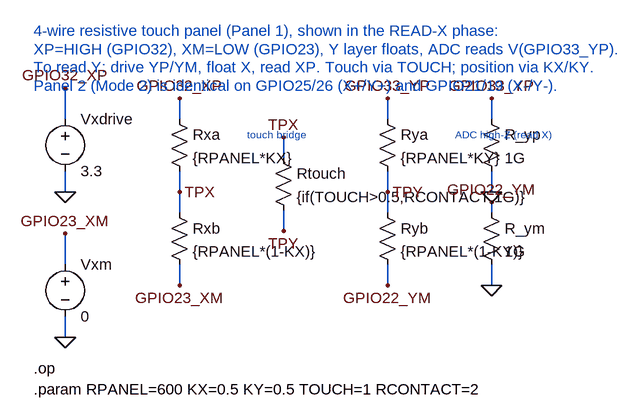
[diagram p0: schematic touch_panel.asc]
touch_panel.asc, the LTspice schematic file:
Version 4
SHEET 1 880 760
WIRE -160 -32 -160 16
WIRE -160 96 -160 128
WIRE -160 192 -160 240
WIRE -160 320 -160 352
WIRE 16 -16 16 16
WIRE 16 96 16 128
WIRE 16 128 16 160
WIRE 16 240 16 272
WIRE 176 44 176 76
WIRE 176 156 176 188
WIRE 336 -16 336 16
WIRE 336 96 336 128
WIRE 336 128 336 160
WIRE 336 240 336 272
WIRE 496 -16 496 16
WIRE 496 96 496 128
WIRE 496 144 496 160
WIRE 496 240 496 272
FLAG -160 -32 GPIO32_XP
FLAG -160 128 0
FLAG -160 192 GPIO23_XM
FLAG -160 352 0
FLAG 16 -16 GPIO32_XP
FLAG 16 128 TPX
FLAG 16 272 GPIO23_XM
FLAG 176 44 TPX
FLAG 176 188 TPY
FLAG 336 -16 GPIO33_YP
FLAG 336 128 TPY
FLAG 336 272 GPIO22_YM
FLAG 496 -16 GPIO33_YP
FLAG 496 128 0
FLAG 496 144 GPIO22_YM
FLAG 496 272 0
SYMBOL voltage -160 0 R0
SYMATTR InstName Vxdrive
SYMATTR Value 3.3
SYMBOL voltage -160 224 R0
SYMATTR InstName Vxm
SYMATTR Value 0
SYMBOL res 0 0 R0
SYMATTR InstName Rxa
SYMATTR Value {RPANEL*KX}
SYMBOL res 0 144 R0
SYMATTR InstName Rxb
SYMATTR Value {RPANEL*(1-KX)}
SYMBOL res 320 0 R0
SYMATTR InstName Rya
SYMATTR Value {RPANEL*KY}
SYMBOL res 320 144 R0
SYMATTR InstName Ryb
SYMATTR Value {RPANEL*(1-KY)}
SYMBOL res 160 60 R0
SYMATTR InstName Rtouch
SYMATTR Value {if(TOUCH>0.5,RCONTACT,1G)}
SYMBOL res 480 0 R0
SYMATTR InstName R_yp
SYMATTR Value 1G
SYMBOL res 480 144 R0
SYMATTR InstName R_ym
SYMATTR Value 1G
TEXT -208 -120 Left 2 ;4-wire resistive touch panel (Panel 1), shown in the READ-X phase:
TEXT -208 -92 Left 2 ;XP=HIGH (GPIO32), XM=LOW (GPIO23), Y layer floats, ADC reads V(GPIO33_YP).
TEXT -208 -64 Left 2 ;To read Y: drive YP/YM, float X, read XP. Touch via TOUCH; position via KX/KY.
TEXT -208 -36 Left 2 ;Panel 2 (Mode 2) is identical on GPIO25/26 (X+/Y+) and GPIO21/19 (X-/Y-).
TEXT 120 40 Left 1 ;touch bridge
TEXT 440 40 Left 1 ;ADC high-Z (read X)
TEXT -208 400 Left 2 !.op
TEXT -208 432 Left 2 !.param RPANEL=600 KX=0.5 KY=0.5 TOUCH=1 RCONTACT=2

The netlist it stands for:
* touch_panel.asc
Vxdrive GPIO32_XP 0 3.3
Vxm GPIO23_XM 0 0
Rxa GPIO32_XP TPX {RPANEL*KX}
Rxb TPX GPIO23_XM {RPANEL*(1-KX)}
Rya GPIO33_YP TPY {RPANEL*KY}
Ryb TPY GPIO22_YM {RPANEL*(1-KY)}
Rtouch TPX TPY {if(TOUCH>0.5,RCONTACT,1G)}
R_yp GPIO33_YP 0 1G
R_ym GPIO22_YM 0 1G
* 4-wire resistive touch panel (Panel 1), shown in the READ-X phase:
* XP=HIGH (GPIO32), XM=LOW (GPIO23), Y layer floats, ADC reads V(GPIO33_YP).
* To read Y: drive YP/YM, float X, read XP. Touch via TOUCH; position via KX/KY.
* Panel 2 (Mode 2) is identical on GPIO25/26 (X+/Y+) and GPIO21/19 (X-/Y-).
* touch bridge
* ADC high-Z (read X)
.op
.param RPANEL=600 KX=0.5 KY=0.5 TOUCH=1 RCONTACT=2
.backanno
.end